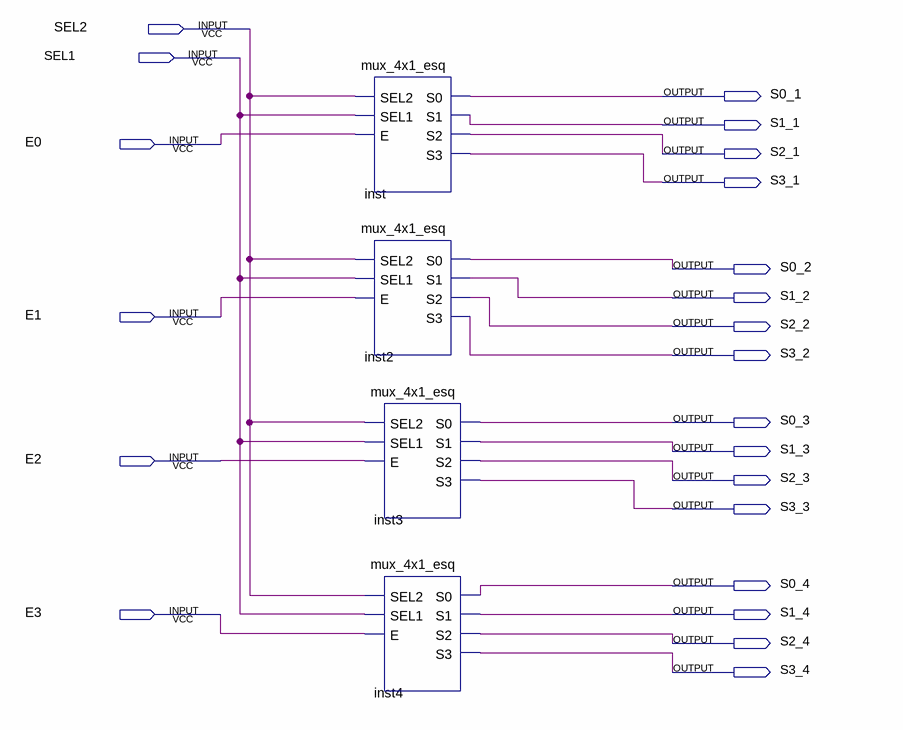
[diagram p0: schematic sheet]
// Quartus schematic mux4x1_4bits.bdf as structural Verilog: 4 symbols, 22 pins
module mux4x1_4bits (
  input  SEL2,
  input  SEL1,
  input  E0,
  input  E1,
  input  E2,
  input  E3,
  output S0_1,
  output S1_1,
  output S2_1,
  output S3_1,
  output S0_2,
  output S1_2,
  output S2_2,
  output S3_2,
  output S0_3,
  output S1_3,
  output S2_3,
  output S3_3,
  output S0_4,
  output S1_4,
  output S2_4,
  output S3_4
);

  mux_4x1_esq inst (.SEL2(SEL2), .SEL1(SEL1), .E(E0), .S0(S0_1), .S1(S1_1), .S2(S2_1), .S3(S3_1));
  mux_4x1_esq inst2 (.SEL2(SEL2), .SEL1(SEL1), .E(E1), .S0(S0_2), .S1(S1_2), .S2(S2_2), .S3(S3_2));
  mux_4x1_esq inst3 (.SEL2(SEL2), .SEL1(SEL1), .E(E2), .S0(S0_3), .S1(S1_3), .S2(S2_3), .S3(S3_3));
  mux_4x1_esq inst4 (.SEL2(SEL2), .SEL1(SEL1), .E(E3), .S0(S0_4), .S1(S1_4), .S2(S2_4), .S3(S3_4));
endmodule
